# EAGLE schematic TeensyPinout (EAGLE 8.4.3)
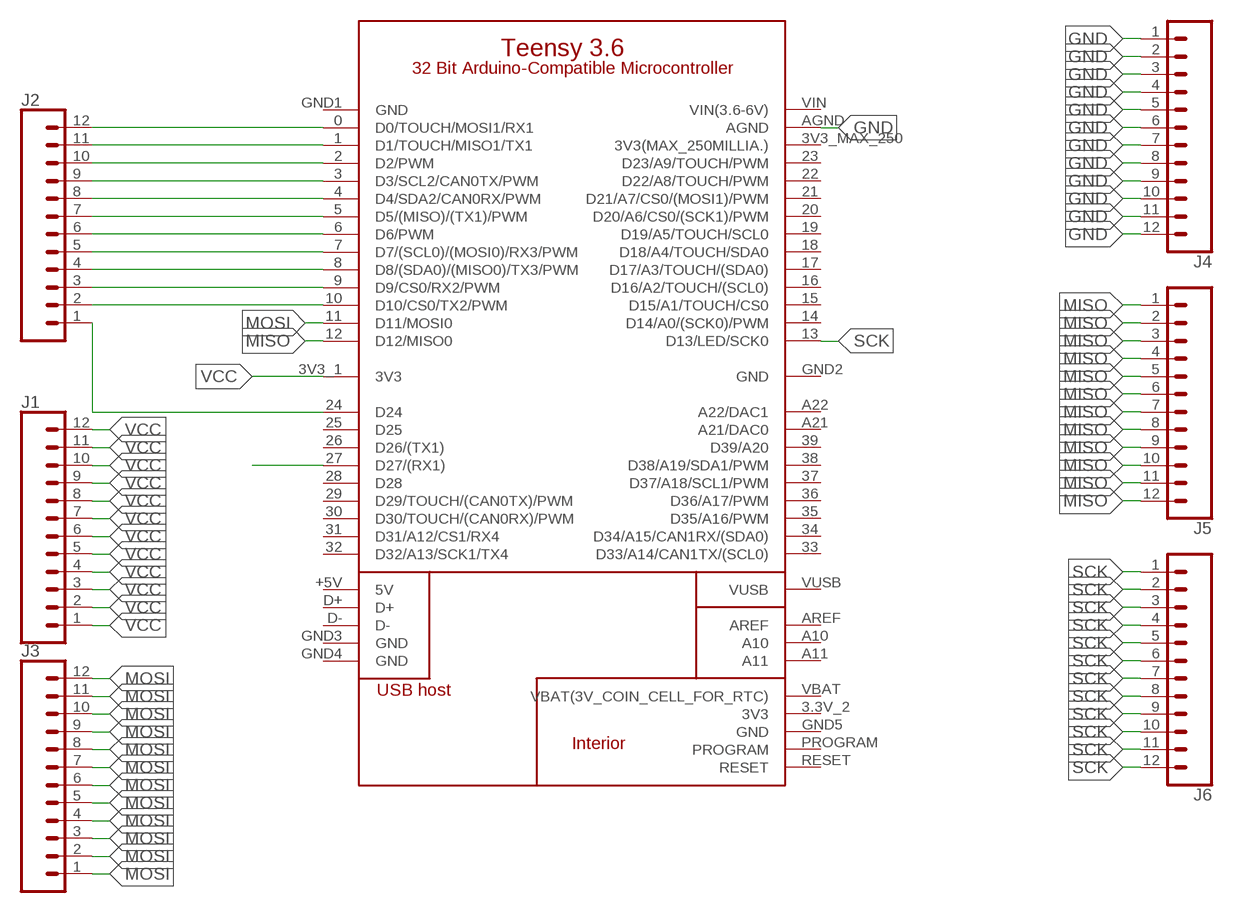
[diagram p0: schematic, sheet 1]

## Parts
J1  CONN_12  [1X12]
J2  CONN_12  [1X12]
J3  CONN_12  [1X12]
J4  CONN_12  [1X12]
J5  CONN_12  [1X12]
J6  CONN_12  [1X12]
U$2  TEENSY-3.6_ONLY_HOLES  [TEENSY-3.6_ONLY_HOLES]

## Nets
GND: J4.1 J4.2 J4.3 J4.4 J4.5 J4.6 J4.7 J4.8 J4.9 J4.10 J4.11 J4.12 U$2.AGND
MISO: J5.1 J5.2 J5.3 J5.4 J5.5 J5.6 J5.7 J5.8 J5.9 J5.10 J5.11 J5.12 U$2.12(D12/MISO0)
MOSI: J3.1 J3.2 J3.3 J3.4 J3.5 J3.6 J3.7 J3.8 J3.9 J3.10 J3.11 J3.12 U$2.11(D11/MOSI0)
N$2: J2.12 U$2.0(D0/TOUCH/MOSI1/RX1)
N$3: J2.10 U$2.2(D2/PWM)
N$5: U$2.27(D27/(RX1))
N$6: J2.9 U$2.3(D3/SCL2/CAN0TX/PWM)
N$7: J2.11 U$2.1(D1/TOUCH/MISO1/TX1)
N$8: J2.8 U$2.4(D4/SDA2/CAN0RX/PWM)
N$9: J2.7 U$2.5(D5/(MISO)/(TX1)/PWM)
N$10: J2.6 U$2.6(D6/PWM)
N$11: J2.5 U$2.7(D7/(SCL0)/(MOSI0)/RX3/PWM)
N$12: J2.4 U$2.8(D8/(SDA0)/(MISO0)/TX3/PWM)
N$13: J2.3 U$2.9(D9/CS0/RX2/PWM)
N$14: J2.2 U$2.10(D10/CS0/TX2/PWM)
N$15: J2.1 U$2.24(D24)
SCK: J6.1 J6.2 J6.3 J6.4 J6.5 J6.6 J6.7 J6.8 J6.9 J6.10 J6.11 J6.12 U$2.13(D13/LED/SCK0)
VCC: J1.1 J1.2 J1.3 J1.4 J1.5 J1.6 J1.7 J1.8 J1.9 J1.10 J1.11 J1.12 U$2.3V3_1(3V3)
Unconnected: U$2.3.3V_2(3V3) U$2.3V3_MAX_250(3V3(MAX_250MILLIA.)) U$2.14(D14/A0/(SCK0)/PWM) U$2.15(D15/A1/TOUCH/CS0) U$2.16(D16/A2/TOUCH/(SCL0)) U$2.17(D17/A3/TOUCH/(SDA0)) U$2.18(D18/A4/TOUCH/SDA0) U$2.19(D19/A5/TOUCH/SCL0) U$2.20(D20/A6/CS0/(SCK1)/PWM) U$2.21(D21/A7/CS0/(MOSI1)/PWM) U$2.22(D22/A8/TOUCH/PWM) U$2.23(D23/A9/TOUCH/PWM) U$2.25(D25) U$2.26(D26/(TX1)) U$2.28(D28) U$2.29(D29/TOUCH/(CAN0TX)/PWM) U$2.30(D30/TOUCH/(CAN0RX)/PWM) U$2.31(D31/A12/CS1/RX4) U$2.32(D32/A13/SCK1/TX4) U$2.33(D33/A14/CAN1TX/(SCL0)) U$2.34(D34/A15/CAN1RX/(SDA0)) U$2.35(D35/A16/PWM) U$2.36(D36/A17/PWM) U$2.37(D37/A18/SCL1/PWM) U$2.38(D38/A19/SDA1/PWM) U$2.39(D39/A20) U$2.+5V(5V) U$2.A10 U$2.A11 U$2.A21(A21/DAC0) U$2.A22(A22/DAC1) U$2.AREF U$2.D+ U$2.D- U$2.GND3(GND) U$2.GND4(GND) U$2.GND5(GND) U$2.PROGRAM U$2.RESET U$2.VBAT(VBAT(3V_COIN_CELL_FOR_RTC)) U$2.VUSB

## Power pins joined to a net without a drawn wire
GND: U$2.GND1(GND) U$2.GND2(GND)
VIN(3.6-6V): U$2.VIN(VIN(3.6-6V))

## Library data of the parts
J1-J6 = SparkFun-Connectors:CONN_12: Multi connection point. Often used as Generic Header-pin footprint for 0.1 inch spaced/style header connections On any of the 0.1 inch spaced packages, you can populate with these: Break Away Headers - Straight <https://www.sparkfun.com/products/116> (PRT-00116) Break Away Male Headers - Right Angle <https://www.sparkfun.com/products/553> (PRT-00553) Female Headers <https://www.sparkfun.com/products/115> (PRT-00115) Break Away Headers - Machine Pin <https://www.sparkfun.com/products/117> (PRT-00117) Break Away Female Headers - Swiss Machine Pin <https://www.sparkfun.com/products/743> (PRT-00743) For SCREWTERMINALS and SPRING TERMINALS visit here: Screw Terimnals on SparkFun.com <https://www.sparkfun.com/search/results?term=Screw+Terminals> (5mm/3.5mm/2.54mm spacing) This device is also useful as a general connection point to wire up your design to another part of your project. Our various solder wires solder well into these plated through hole pads. Hook-Up Wire - Assortment (Stranded, 22 AWG) <https://www.sparkfun.com/products/11375> (PRT-11375) Hook-Up Wire - Assortment (Solid Core, 22 AWG) <https://www.sparkfun.com/products/11367> (PRT-11367) View the entire wire category on our website here <https://www.sparkfun.com/categories/141> Special notes: Molex polarized connector foot print use with SKU : PRT-08231 with associated crimp pins and housings. 1MM SMD Version SKU: PRT-10208 NOTES ON THE VARIANTS LOCK and LOCK_LONGPADS... This footprint was designed to help hold the alignment of a through-hole component (i.e. 6-pin header) while soldering it into place. You may notice that each hole has been shifted either up or down by 0.005 of an inch from it's more standard position (which is a perfectly straight line). This slight alteration caused the pins (the squares in the middle) to touch the edges of the holes. Because they are alternating, it causes a "brace" to hold the component in place. 0.005 has proven to be the perfect amount of "off-center" position when using our standard breakaway headers. Although looks a little odd when you look at the bare footprint, once you have a header in there, the alteration is very hard to notice. Also,if you push a header all the way into place, it is covered up entirely on the bottom side.
U$2 = Teensy-3.6:TEENSY-3.6_ONLY_HOLES